# EAGLE schematic EEZ CF-DIC r3B7 (EAGLE 6.1)
Assembly variants: Farnell, TME

## Sheet 1 of 3
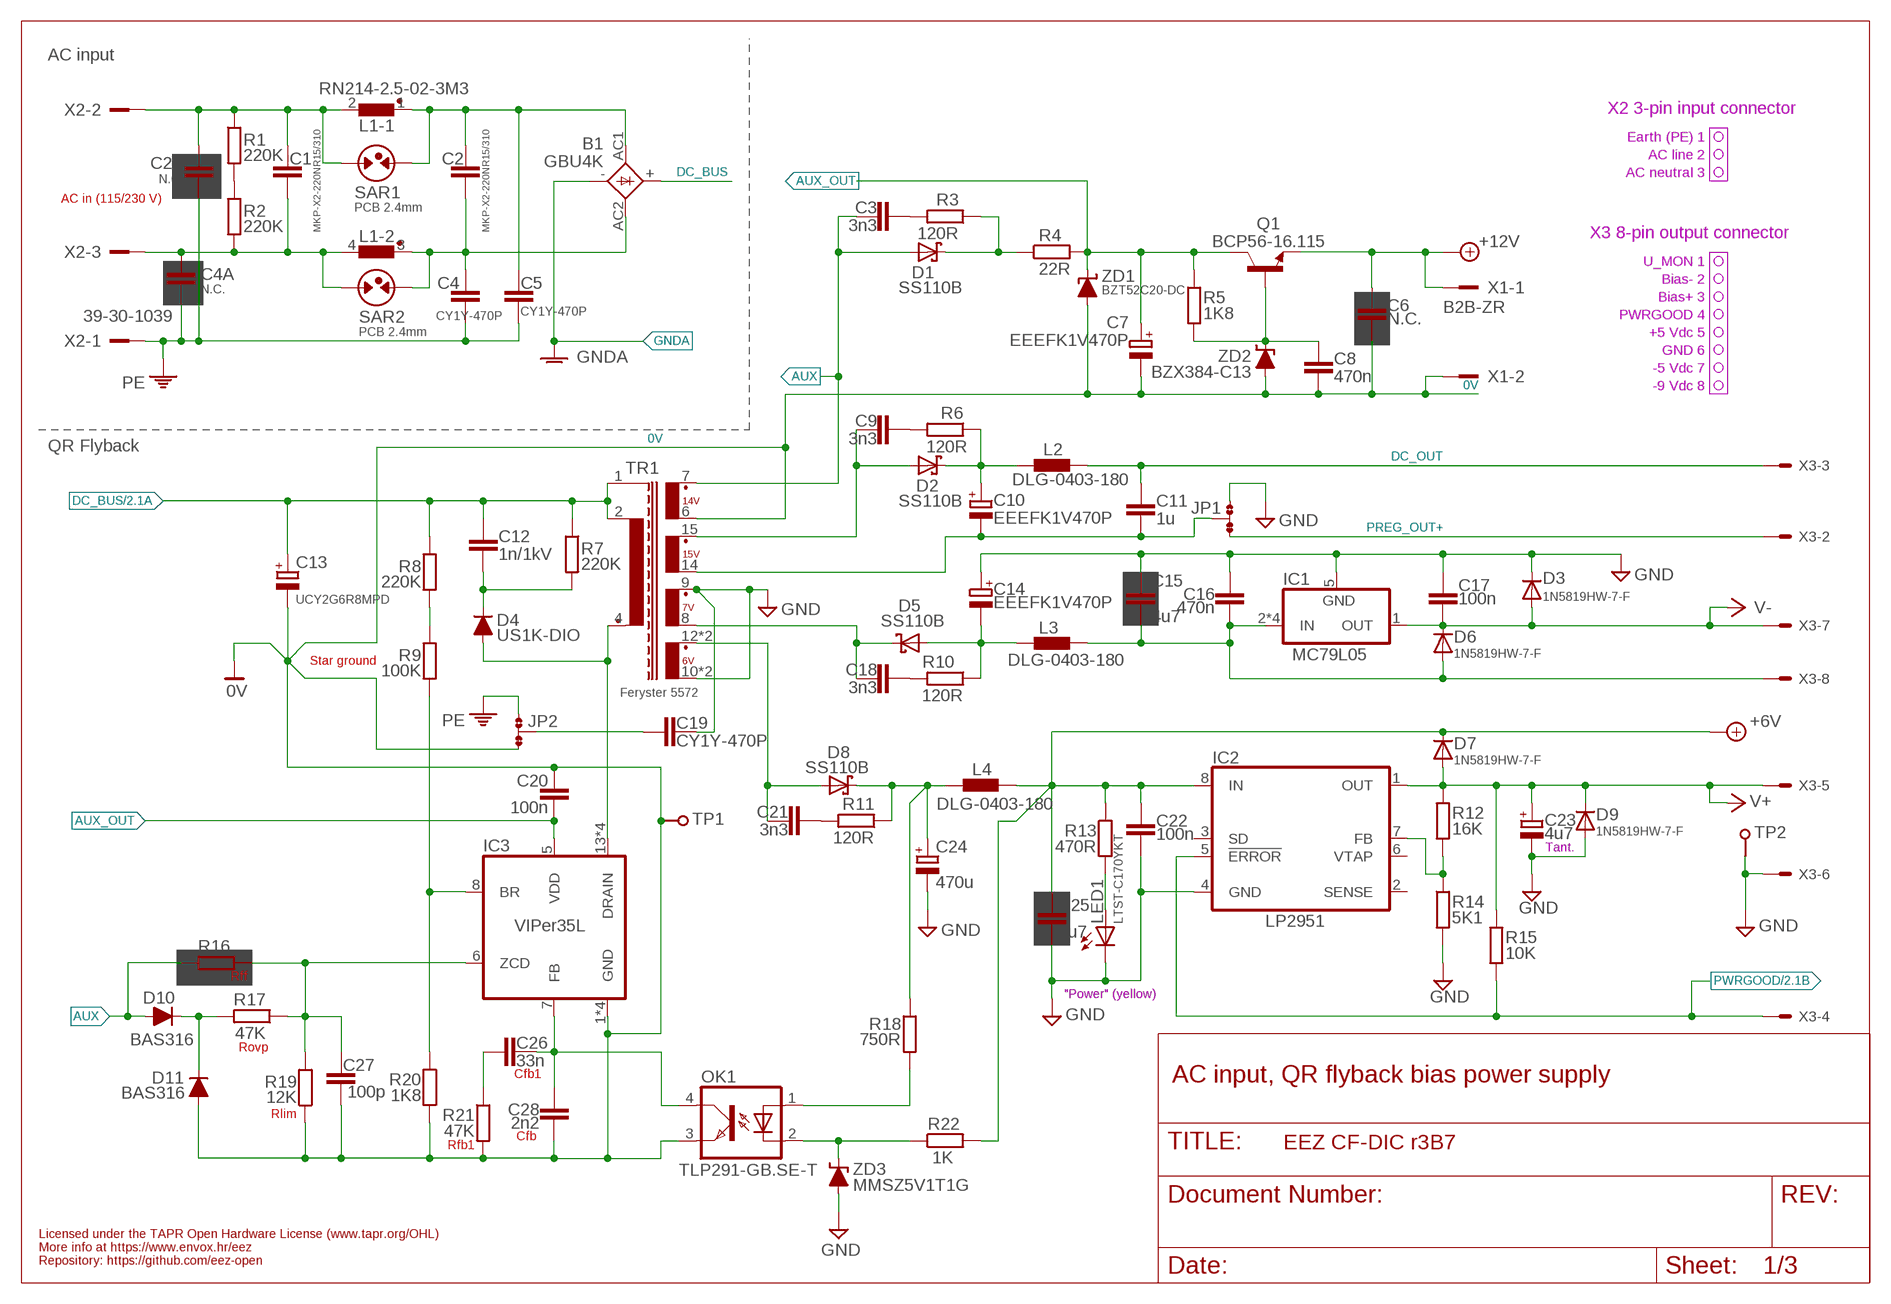
[diagram p0: schematic, sheet 1]

### Parts
B1  GBU4K  BRIDGE-CREEPAGE  [GBU4K_CRE]
C1  MKP-X2-220NR15/310  C-EU150-072X183  [C150-072X183]
C2  MKP-X2-220NR15/310  C-EU150-072X183  [C150-072X183]
C2A  N.C.  C-EUCY  [CY075-032X103]
C3  3n3  C-EUC0805  [C0805]
C4  CY1Y-470P  C-EUCY  [CY075-032X103]
C4A  N.C.  C-EUCY  [CY075-032X103]
C5  CY1Y-470P  C-EUCY  [CY075-032X103]
C6  N.C.  C-EUC0603  [C0603]
C7  EEEFK1V470P  ECAPPANASONIC_H  [CAPAE660X610N]
C8  470n  C-EUC0805  [C0805]
C9  3n3  C-EUC0805  [C0805]
C10  EEEFK1V470P  ECAPPANASONIC_H  [CAPAE660X610N]
C11  1u  C-EUC0805  [C0805]
C12  1n/1kV  C-EUC1210  [C1210]
C13  UCY2G6R8MPD  ECAP5G_10.5MM  [ECAP5/10.5]
C14  EEEFK1V470P  ECAPPANASONIC_H  [CAPAE660X610N]
C15  4u7  C-EUC1206  [C1206]
C16  470n  C-EUC0805  [C0805]
C17  100n  C-EUC0603  [C0603]
C18  3n3  C-EUC0805  [C0805]
C19  CY1Y-470P  C-EUCY  [CY075-032X103]
C20  100n  C-EUC0603  [C0603]
C21  3n3  C-EUC0805  [C0805]
C22  100n  C-EUC0603  [C0603]
C23  4u7  ECAP1206  [EC1206]
C24  470u  ECAP5G_10.5MM  [ECAP5/10.5]
C25  4u7  C-EUC1206  [C1206]
C26  33n  C-EUC0805  [C0805]
C27  100p  C-EUC0805  [C0805]
C28  2n2  C-EUC0805  [C0805]
D1  SS110B  SCHOTTKYSMB  [SMB]
D2  SS110B  SCHOTTKYSMB  [SMB]
D3  1N5819HW-7-F  DIODE-SOD323-W  [SOD323-W]
D4  US1K-DIO  DIODEDO214AA  [DO214AA]
D5  SS110B  SCHOTTKYSMB  [SMB]
D6  1N5819HW-7-F  DIODE-SOD323-W  [SOD323-W]
D7  1N5819HW-7-F  DIODE-SOD323-W  [SOD323-W]
D8  SS110B  SCHOTTKYSMB  [SMB]
D9  1N5819HW-7-F  DIODE-SOD323-W  [SOD323-W]
D10  BAS316  DIODESOD323R  [SOD323-R]
D11  BAS316  DIODESOD323R  [SOD323-R]
IC1  MC79L05  MC79LXXSOIC  [SOIC127P600X173-8N]
IC2  LP2951  LP2951SO8  [SOIC127P600X175-8N]
IC3  VIPer35L  VIPER35  [SOIC-16]
JP1  JP3-CUT  [JP3-CUT]
JP2  JP3-CUT  [JP3-CUT]
L1  RN214-2.5-02-3M3  RN214  [RN214]
L2  DLG-0403-180  DE0403  [DE0403]
L3  DLG-0403-180  DE0403  [DE0403]
L4  DLG-0403-180  DE0403  [DE0403]
LED1  LTST-C170YKT  LED0805  [LED_0805]
OK1  TLP291-GB.SE-T  TLP291  [SO4]
Q1  BCP56-16.115  BCP56  [SOT230P700X180-4N]
R1  220K  R-EU_R1206  [R1206]
R2  220K  R-EU_R1206  [R1206]
R3  120R  R-EU_R0805  [R0805]
R4  22R  R-EU_R0805  [R0805]
R5  1K8  R-EU_R0805  [R0805]
R6  120R  R-EU_R0805  [R0805]
R7  220K  R-EU_R1206  [R1206]
R8  220K  R-EU_R1206  [R1206]
R9  100K  R-EU_R0805  [R0805]
R10  120R  R-EU_R0805  [R0805]
R11  120R  R-EU_R0805  [R0805]
R12  16K  R-EU_R0805  [R0805]
R13  470R  R-EU_R0805  [R0805]
R14  5K1  R-EU_R0805  [R0805]
R15  10K  R-EU_R0805  [R0805]
R16  N.C.  R-EU_R0805  [R0805]
R17  47K  R-EU_R0805  [R0805]
R18  750R  R-EU_R0805  [R0805]
R19  12K  R-EU_R0805  [R0805]
R20  1K8  R-EU_R0805  [R0805]
R21  47K  R-EU_R0805  [R0805]
R22  1K  R-EU_R0805  [R0805]
SAR1  PCB 2.4mm  SARPCB-2.4MM  [PCB-SAR_2.4MM]
SAR2  PCB 2.4mm  SARPCB-2.4MM  [PCB-SAR_2.4MM]
TP1  PCB_TEST_TABSHIELD  [PCB_SHIELD_TAB]
TP2  PCB_TEST_TABSHIELD  [PCB_SHIELD_TAB]
TR1  Feryster 5572  FERYSTER_5572  [FERYSTER_5572]
X1  B2B-ZR  [B2B-ZR]
X2  39-30-1039  MINIFIT_39301039-CREEPAGE  [MINIFIT_39301039_CRE]
X3  90136-1208  C-GRID-08-70543  [70543-08]
ZD1  BZT52C20-DC  ZENER-DIODESOD123FL  [SOD123FL]
ZD2  BZX384-C13  ZENER-DIODESOD323  [SOD323-W]
ZD3  MMSZ5V1T1G  ZENER-DIODESOD323  [SOD323-W]

### Nets
0V: C6.2 C7.2(-) C8.2 C13.- C20.1 C27.2 C28.2 D11.A IC3.1(GND) IC3.2(GND) IC3.3(GND) IC3.4(GND) JP2.NC OK1.3(EMIT) R19.1 R20.2 R21.2 TP1.1 TR1.6(S_BIAS) X1.2 ZD1.A ZD2.A ; also sheet 2
6VAC: C21.2 D8.A TR1.12(S1_DOT) TR1.13(S1_DOT)
7VAC: C18.2 D5.C TR1.8(S2)
15VAC: C9.2 D2.A TR1.15(S3_DOT)
+6V: C22.1 C25.1 D7.C IC2.8(IN) L4.2 R13.1 R22.2 ; also sheet 3
+6V_REC: C24.+ D8.C L4.1 R11.1 R18.1
+12V: C6.1 Q1.3(E) X1.1 ; also sheet 2
+15V_REC: C10.1(+) D2.C L2.1 R6.1
-7V_REC: C14.2(-) D5.A L3.1 R10.1
-9V: C15.2 C16.2 D6.A IC1.2(IN) IC1.3(IN) IC1.6(IN) IC1.7(IN) L3.2 X3.8
-15V: C10.2(-) C11.2 JP1.COM TR1.14(S3)
AUX: C3.2 D1.A D10.A R16.2 TR1.7(S_BIAS_DOT)
AUX_OUT: C7.1(+) C20.2 IC3.5(VDD) Q1.2(C) Q1.4(C) R4.2 R5.1 ZD1.C
DC_BUS: B1.+ C12.1 C13.+ R7.1 R8.1 TR1.1(SHIELD) TR1.2(P) ; also sheet 2
DC_OUT: C11.1 L2.2 X3.3
FB2: OK1.2(C) R22.1 ZD3.C
GND: C14.1(+) C15.1 C16.1 C17.1 C19.2 C22.2 C23.- C24.- C25.2 D3.C D9.A IC1.5(GND) IC2.4(GND) JP1.NO LED1.C R14.2 TP2.1 TR1.9(S2_DOT) TR1.10(S1) TR1.11(S1) X3.6 ZD3.A ; also sheet 2,3
GNDA: B1.- ; also sheet 2
N$4: C19.1 JP2.COM
N$11: LED1.A R13.2
N$15: B1.AC1 C2.1 C5.2 L1.1 SAR1.2
N$20: IC3.8(BR) R9.2 R20.1
N$24: B1.AC2 C2.2 C4.2 L1.3 SAR2.2
N$27: D1.C R3.1 R4.1
N$28: C1.1 C2A.2 L1.2 R1.1 SAR1.1 X2.2
N$30: C1.2 C4A.2 L1.4 R2.2 SAR2.1 X2.3
N$33: R1.2 R2.1
N$49: R8.2 R9.1
N$101: IC2.7(FB) R12.2 R14.1
N$133: C8.1 Q1.1(B) R5.2 ZD2.C
N$135: OK1.1(A) R18.2
N$137: C12.2 D4.C R7.2
N$138: C26.2 C28.1 IC3.7(FB) OK1.4(COL)
N$139: C9.1 R6.2
N$140: C3.1 R3.2
N$141: C27.1 IC3.6(ZCD) R16.1 R17.1 R19.2
N$144: C18.1 R10.2
N$146: C21.1 R11.2
N$152: C26.1 R21.1
N$155: D10.C D11.C R17.2
PE: C2A.1 C4.1 C4A.1 C5.1 JP2.NO X2.1
PREG_OUT+: JP1.NC X3.2 ; also sheet 3
PWRGOOD: IC2.5(!ERROR) R15.2 X3.4 ; also sheet 2
V+: C23.+ D7.A D9.C IC2.1(OUT) R12.1 R15.1 X3.5 ; also sheet 3
V-: C17.2 D3.A D6.C IC1.1(OUT) X3.7 ; also sheet 3
VIPER_D: D4.A IC3.13(DRAIN) IC3.14(DRAIN) IC3.15(DRAIN) IC3.16(DRAIN) TR1.4(P2_DOT)
Unconnected: IC2.2(SENSE) IC2.3(SD) IC2.6(VTAP)

### Notes on the sheet
- AC input
- X2 3-pin input connector
- Earth (PE) 1
- AC line 2
- AC neutral 3
- AC in (115/230 V)
- X3 8-pin output connector
- U_MON 1
- Bias- 2
- Bias+ 3
- PWRGOOD 4
- +5 Vdc 5
- GND 6
- -5 Vdc 7
- -9 Vdc 8
- QR Flyback
- Star ground
- Tant.
- Rff
- "Power" (yellow)
- Rovp
- Cfb1
- AC input, QR flyback bias power supply
- Rlim
- Cfb
- Rfb1
- Licensed under the TAPR Open Hardware License (www.tapr.org/OHL)
- More info at https://www.envox.hr/eez
- Repository: https://github.com/eez-open

## Sheet 2 of 3
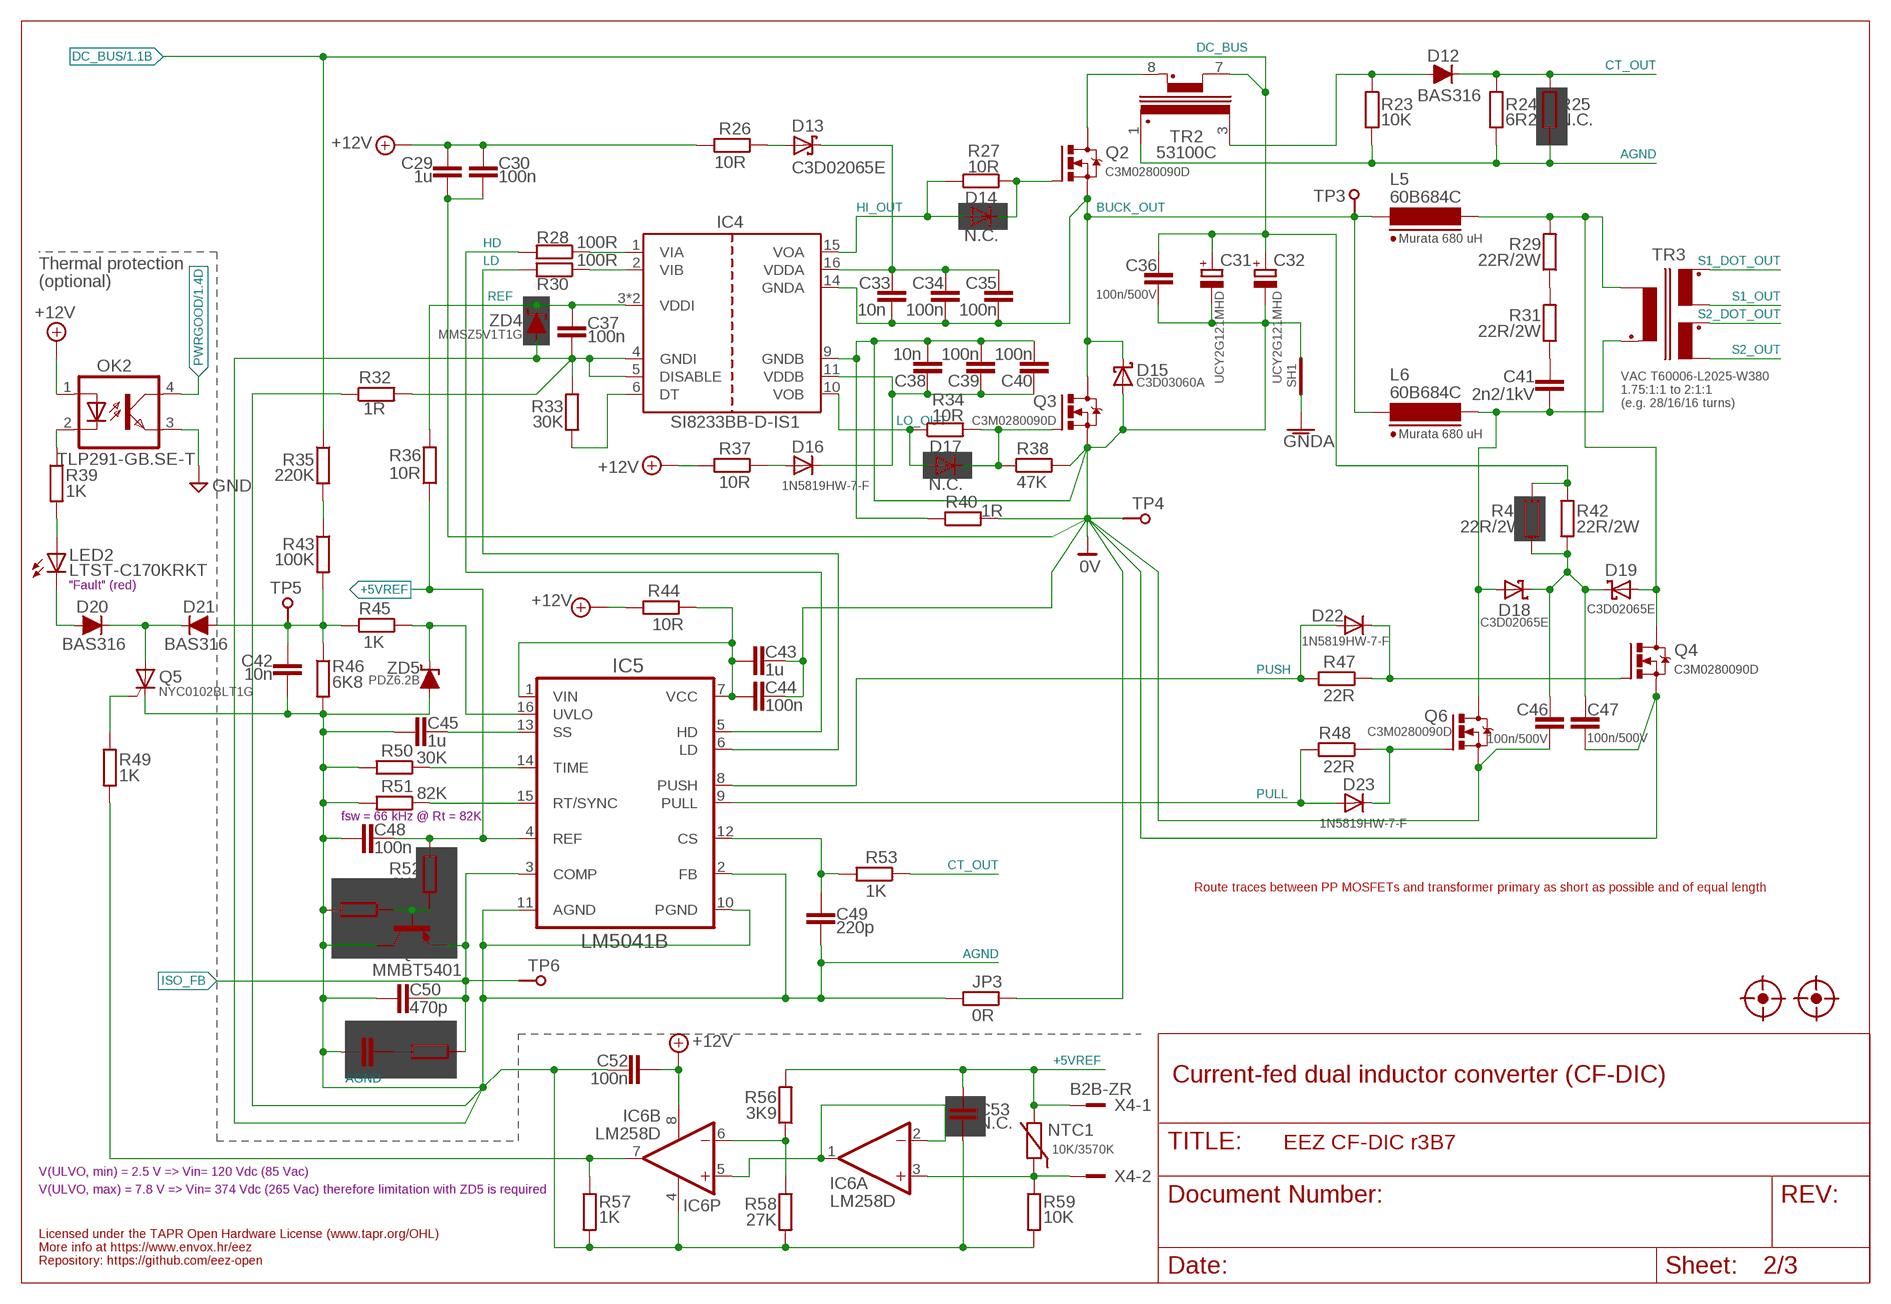
[diagram p1: schematic, sheet 2]

### Parts
C29  1u  C-EUC0805  [C0805]
C30  100n  C-EUC0603  [C0603]
C31  UCY2G121MHD  ECAP7.5G_18MM  [ECAP7.5/18]
C32  UCY2G121MHD  ECAP7.5G_18MM  [ECAP7.5/18]
C33  10n  C-EUC0603  [C0603]
C34  100n  C-EUC0603  [C0603]
C35  100n  C-EUC0603  [C0603]
C36  100n/500V  C-EUC1812  [C1812]
C37  100n  C-EUC0603  [C0603]
C38  10n  C-EUC0603  [C0603]
C39  100n  C-EUC0603  [C0603]
C40  100n  C-EUC0603  [C0603]
C41  2n2/1kV  C-EUC1210  [C1210]
C42  10n  C-EUC0603  [C0603]
C43  1u  C-EUC0805  [C0805]
C44  100n  C-EUC0603  [C0603]
C45  1u  C-EUC0805  [C0805]
C46  100n/500V  C-EUC1812  [C1812]
C47  100n/500V  C-EUC1812  [C1812]
C48  100n  C-EUC0603  [C0603]
C49  220p  C-EUC0805  [C0805]
C50  470p  C-EUC0805  [C0805]
C51  N.C.  C-EUC0805  [C0805]
C52  100n  C-EUC0603  [C0603]
C53  N.C.  C-EUC0603  [C0603]
D12  BAS316  DIODESOD323R  [SOD323-R]
D13  C3D02065E  SCHOTTKY-SIC  [TO252]
D14  N.C.  DIODE-SOD323-W  [SOD323-W]
D15  C3D03060A  SCHOTTKY-TO220  [TO220-2]
D16  1N5819HW-7-F  DIODE-SOD323-W  [SOD323-W]
D17  N.C.  DIODE-SOD323-W  [SOD323-W]
D18  C3D02065E  SCHOTTKY-SIC  [TO252]
D19  C3D02065E  SCHOTTKY-SIC  [TO252]
D20  BAS316  DIODESOD323R  [SOD323-R]
D21  BAS316  DIODESOD323R  [SOD323-R]
D22  1N5819HW-7-F  DIODE-SOD323-W  [SOD323-W]
D23  1N5819HW-7-F  DIODE-SOD323-W  [SOD323-W]
FM1  FIDUCIAL_2  [FIDUCIAL_DUAL]
FM2  FIDUCIAL_2  [FIDUCIAL_DUAL]
IC4  SI8233BB-D-IS1  SI8233  [SOIC-16]
IC5  LM5041B  LM5041  [MTC16]
IC6  LM258D  TL072SOIC8  [SOIC127P600X173-8N]
JP3  0R  R-EU_R0805  [R0805]
L5  60B684C  MURATA_6000B  [MURATA_6000B]
L6  60B684C  MURATA_6000B  [MURATA_6000B]
LED2  LTST-C170KRKT  LED0805  [LED_0805]
NTC1  10K/3570K  NTCR_0805  [R_0805]
OK2  TLP291-GB.SE-T  TLP291  [SO4]
Q2  C3M0280090D  IRFP240  [TO247BV]
Q3  C3M0280090D  IRFP240  [TO247BV]
Q4  C3M0280090D  IRFP240  [TO247BV]
Q5  NYC0102BLT1G  [SOT23]
Q6  C3M0280090D  IRFP240  [TO247BV]
Q7  MMBT5401  BC857B-PNP-SOT23-BEC  [SOT23-BEC]
R23  10K  R-EU_R0805  [R0805]
R24  6R2  R-EU_R0805  [R0805]
R25  N.C.  R-EU_R0805  [R0805]
R26  10R  R-EU_R0805  [R0805]
R27  10R  R-EU_R0805  [R0805]
R28  100R  R-EU_R0805  [R0805]
R29  22R/2W  R-EU_R2512  [R2512]
R30  100R  R-EU_R0805  [R0805]
R31  22R/2W  R-EU_R2512  [R2512]
R32  1R  R-EU_R0805  [R0805]
R33  30K  R-EU_R0805  [R0805]
R34  10R  R-EU_R0805  [R0805]
R35  220K  R-EU_R1206  [R1206]
R36  10R  R-EU_R0805  [R0805]
R37  10R  R-EU_R0805  [R0805]
R38  47K  R-EU_R0805  [R0805]
R39  1K  R-EU_R0805  [R0805]
R40  1R  R-EU_R0805  [R0805]
R41  22R/2W  R-EU_R2512  [R2512]
R42  22R/2W  R-EU_R2512  [R2512]
R43  100K  R-EU_R0805  [R0805]
R44  10R  R-EU_R0805  [R0805]
R45  1K  R-EU_R0805  [R0805]
R46  6K8  R-EU_R0805  [R0805]
R47  22R  R-EU_R0805  [R0805]
R48  22R  R-EU_R0805  [R0805]
R49  1K  R-EU_R0805  [R0805]
R50  30K  R-EU_R0805  [R0805]
R51  82K  R-EU_R0805  [R0805]
R52  6K8  R-EU_R0805  [R0805]
R53  1K  R-EU_R0805  [R0805]
R54  6K8  R-EU_R0805  [R0805]
R55  N.C.  R-EU_R0805  [R0805]
R56  3K9  R-EU_R0805  [R0805]
R57  1K  R-EU_R0805  [R0805]
R58  27K  R-EU_R0805  [R0805]
R59  10K  R-EU_R0805  [R0805]
SH1  SHORTNOHOLE  [SHORT_NOHOLE]
TP3  PCB_TEST_TABSHIELD  [PCB_SHIELD_TAB]
TP4  PCB_TEST_TABSHIELD  [PCB_SHIELD_TAB]
TP5  PCB_TEST_TABSHIELD  [PCB_SHIELD_TAB]
TP6  PCB_TEST_TABSHIELD  [PCB_SHIELD_TAB]
TR2  53100C  MURATA_5300  [MURATA_5300]
TR3  VAC T60006-L2025-W380  PCB_TRAFO_FLYBACK2-VAC  [VAC_DUAL_SEC]
X4  B2B-ZR  [B2B-ZR]
ZD4  MMSZ5V1T1G  ZENER-DIODESOD323  [SOD323-W]
ZD5  PDZ6.2B  ZENER-DIODESOD323  [SOD323-W]

### Nets
0V: C29.1 C30.1 C31.- C32.- C36.1 C38.2 C39.2 C40.2 C43.2 C44.2 C46.1 C47.1 D15.2(A) IC4.9(GNDB) JP3.1 Q3.S Q4.S Q6.S R38.2 R40.1 R40.2 SH1.P$2(GND_B) TP4.1 ; also sheet 1
+5VREF: C48.2 C53.1 IC5.4(REF) NTC1.1 R36.1 R52.1 R56.2 X4.1
+12V: C29.2 C30.2 C52.1 IC6.8(P:V+) OK2.1(A) R26.2 R37.2 R44.2 ; also sheet 1
AGND: C37.1 C42.2 C45.1 C48.1 C49.1 C50.1 C51.1 C52.2 C53.2 IC4.4(GNDI) IC4.5(DISABLE) IC5.2(FB) IC5.10(PGND) IC5.11(AGND) IC6.4(P:V-) JP3.2 Q5.1(C) Q7.C R23.2 R24.2 R25.2 R32.1 R32.2 R33.1 R46.2 R50.2 R51.2 R54.2 R57.2 R58.2 R59.2 TR2.1(S_DOT) ZD4.A ZD5.A ; also sheet 3
BUCK_OUT: C33.2 C34.2 C35.2 D15.1(C) IC4.14(GNDA) L5.2 L6.2 Q2.S Q3.D TP3.1
CLAMP_C: C46.2 C47.2 D18.1(C) D18.3(C) D19.1(C) D19.3(C) R41.1 R42.1
CT_OUT: D12.C R24.1 R25.1 R53.1
DC_BUS: C31.+ C32.+ C36.2 R35.1 R41.2 R42.2 TR2.7(P) ; also sheet 1
GND: OK2.3(EMIT) ; also sheet 1,3
GNDA: SH1.P$1(GND_A) ; also sheet 1
HD: IC5.5(HD) R28.2
HI_OUT: D14.A IC4.15(VOA) R27.2
ISO_FB: C50.2 IC5.3(COMP) Q7.E R55.1 TP6.1 ; also sheet 3
L_PULL: C41.2 D18.2(A) L6.1 Q6.D TR3.P1_DOT(P_DOT)
L_PUSH: D19.2(A) L5.1 Q4.D R29.2 TR3.P1(P)
LD: IC5.6(LD) R30.2
LO_OUT: D17.A IC4.10(VOB) R34.1
N$2: R35.2 R43.1
N$3: C33.1 C34.1 C35.1 D13.1(C) D13.3(C) IC4.16(VDDA)
N$5: C41.1 R31.1
N$7: IC6.3(A:+IN) NTC1.2 R59.1 X4.2
N$13: D22.C Q4.G R47.1
N$14: D23.C Q6.G R48.1
N$16: LED2.A R39.2
N$19: IC5.15(RT/SYNC) R51.1
N$21: D14.C Q2.G R27.1
N$22: IC5.14(TIME) R50.1
N$23: C45.2 IC5.13(SS)
N$25: IC5.16(UVLO) R45.1 ZD5.C
N$26: IC6.6(B:-IN) R56.1 R58.1
N$29: D17.C Q3.G R34.2 R38.1
N$31: D13.2(A) R26.1
N$32: OK2.2(C) R39.1
N$35: C51.2 R55.2
N$36: IC4.1(VIA) R28.1
N$37: C49.2 IC5.12(CS) R53.2
N$38: IC6.7(B:OUT) R49.2 R57.1
N$40: IC4.2(VIB) R30.1
N$41: R29.1 R31.2
N$42: IC6.1(A:OUT) IC6.2(A:-IN) IC6.5(B:+IN)
N$47: Q7.B R52.2 R54.1
N$48: IC4.6(DT) R33.2
N$50: D12.A R23.1 TR2.3(S)
N$54: C43.1 C44.1 IC5.1(VIN) IC5.7(VCC) R44.1
N$55: C38.1 C39.1 C40.1 D16.C IC4.11(VDDB)
N$56: Q2.D TR2.8(P_DOT)
N$63: D16.A R37.1
N$100: Q5.2(G) R49.1
N$126: D20.C D21.C Q5.3(A)
N$130: D20.A LED2.C
PULL: D23.A IC5.9(PULL) R48.2
PUSH: D22.A IC5.8(PUSH) R47.2
PWRGOOD: OK2.4(COL) ; also sheet 1
REF: C37.2 IC4.3(VDDI) IC4.8(VDDI) R36.2 ZD4.C
S1_DOT_OUT: TR3.S1_DOT ; also sheet 3
S1_OUT: TR3.S1 ; also sheet 3
S2_DOT_OUT: TR3.S2_DOT ; also sheet 3
S2_OUT: TR3.S2 ; also sheet 3
ULVO: C42.1 D21.A R43.2 R45.2 R46.1 TP5.1

### Notes on the sheet
- Murata 680 uH
- Thermal protection
- (optional)
- 1.75:1:1 to 2:1:1
- (e.g. 28/16/16 turns)
- Murata 680 uH
- "Fault" (red)
- fsw = 66 kHz @ Rt = 82K
- Route traces between PP MOSFETs and transformer primary as short as possible and of equal length
- Current-fed dual inductor converter (CF-DIC)
- V(ULVO, min) = 2.5 V => Vin= 120 Vdc (85 Vac)
- V(ULVO, max) = 7.8 V => Vin= 374 Vdc (265 Vac) therefore limitation with ZD5 is required
- Licensed under the TAPR Open Hardware License (www.tapr.org/OHL)
- More info at https://www.envox.hr/eez
- Repository: https://github.com/eez-open

## Sheet 3 of 3
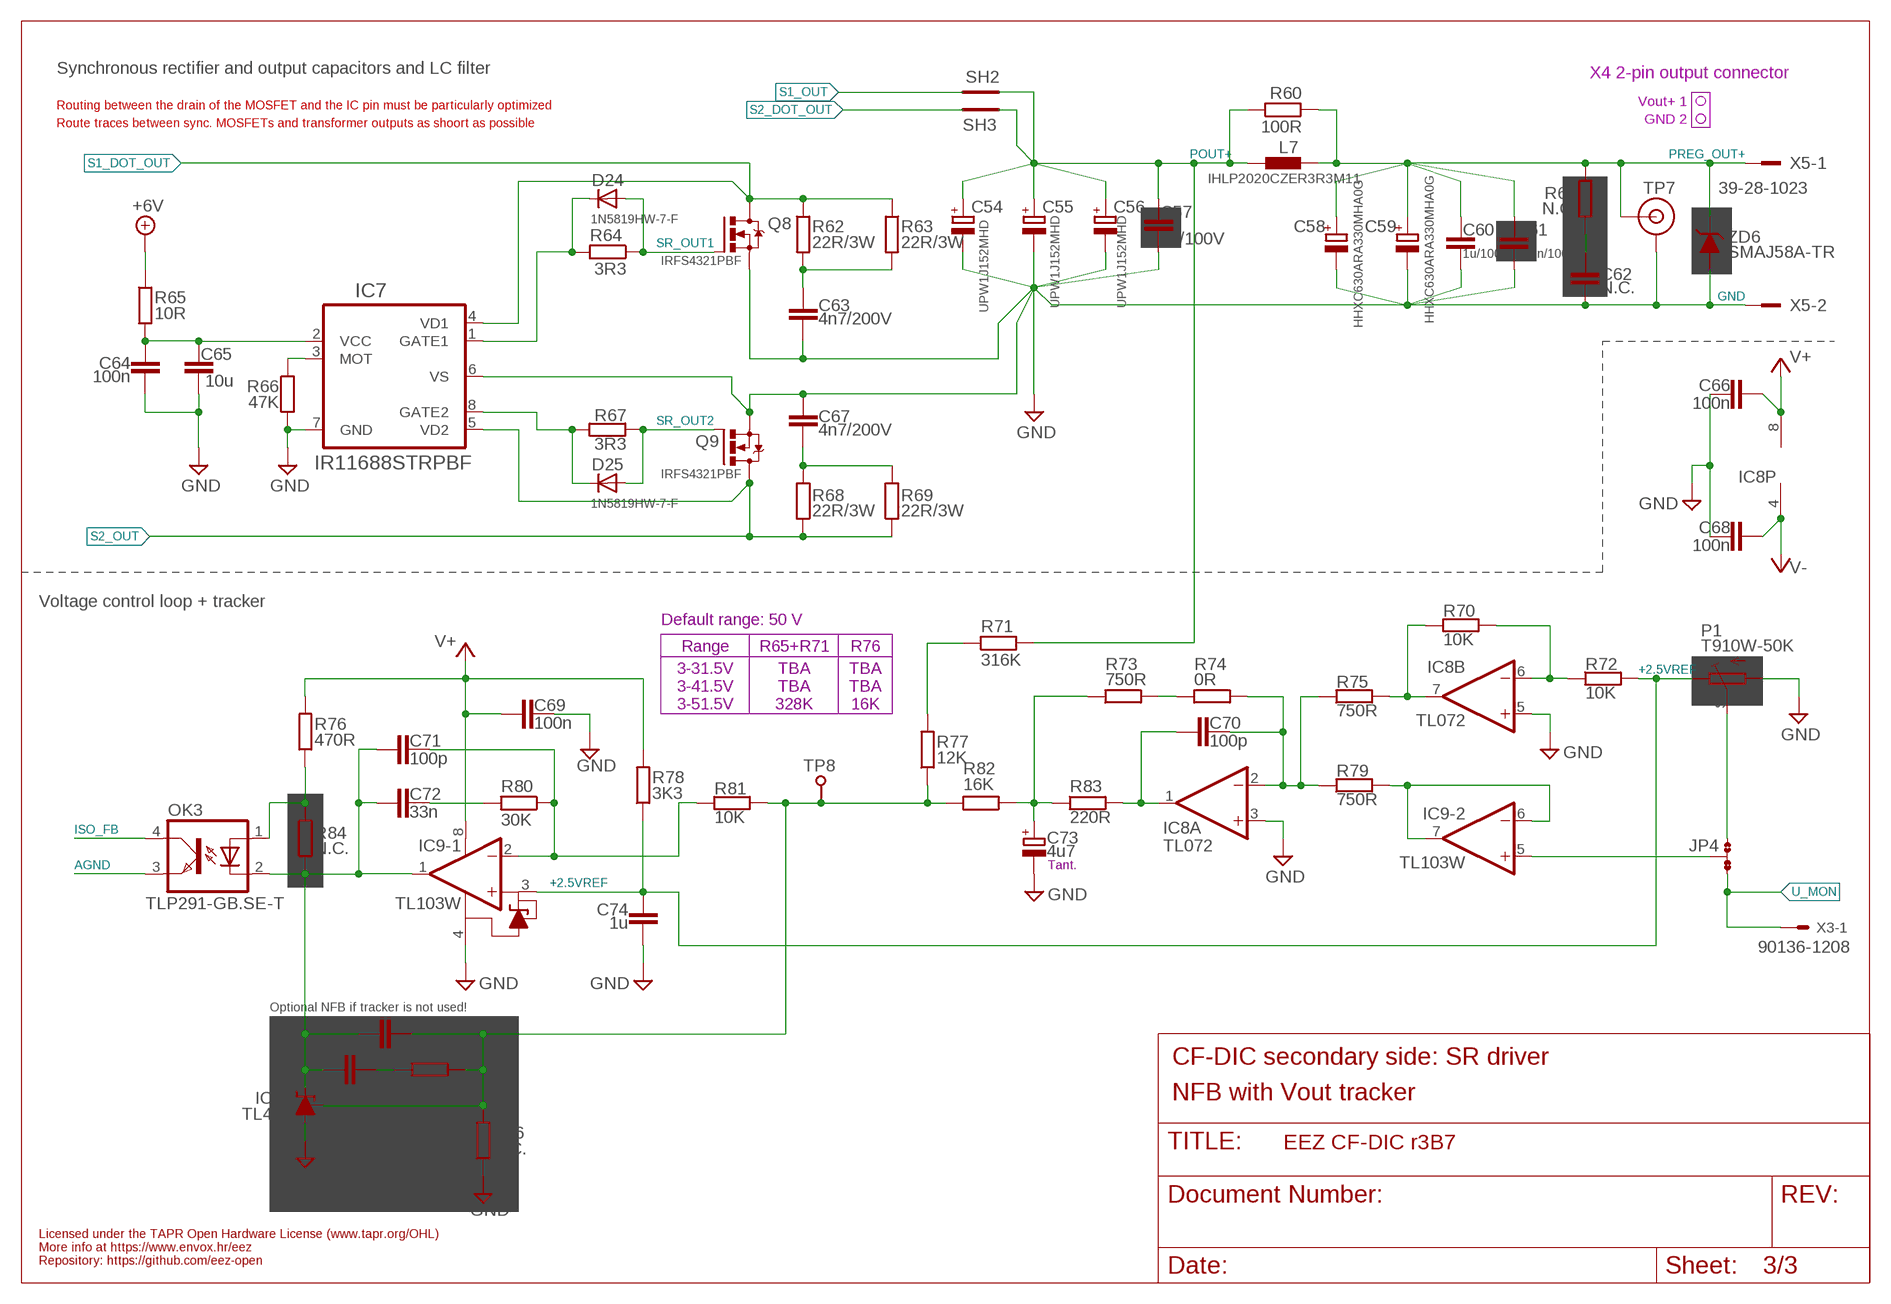
[diagram p2: schematic, sheet 3]

### Parts
C54  UPW1J152MHD  ECAP7.5G_18MM  [ECAP7.5/18]
C55  UPW1J152MHD  ECAP7.5G_18MM  [ECAP7.5/18]
C56  UPW1J152MHD  ECAP7.5G_18MM  [ECAP7.5/18]
C57  1u/100V  C-EUC1206  [C1206]
C58  HHXC630ARA330MHA0G  EEE-FK1J470P-CASE-F  [CAPAE830X1050N]
C59  HHXC630ARA330MHA0G  EEE-FK1J470P-CASE-F  [CAPAE830X1050N]
C60  1u/100V  C-EUC1206  [C1206]
C61  100n/100V  C-EUC0805  [C0805]
C62  N.C.  C-EUC1206  [C1206]
C63  4n7/200V  C-EUC1206  [C1206]
C64  100n  C-EUC0603  [C0603]
C65  10u  C-EUC1210  [C1210]
C66  100n  C-EUC0603  [C0603]
C67  4n7/200V  C-EUC1206  [C1206]
C68  100n  C-EUC0603  [C0603]
C69  100n  C-EUC0603  [C0603]
C70  100p  C-EUC0805  [C0805]
C71  100p  C-EUC0805  [C0805]
C72  33n  C-EUC0805  [C0805]
C73  4u7  ECAP1206  [EC1206]
C74  1u  C-EUC0805  [C0805]
C75  N.C.  C-EUC0805  [C0805]
C76  N.C.  C-EUC0805  [C0805]
D24  1N5819HW-7-F  DIODE-SOD323-W  [SOD323-W]
D25  1N5819HW-7-F  DIODE-SOD323-W  [SOD323-W]
IC7  IR11688STRPBF  IR11688  [SO8]
IC8  TL072  TL072SOIC8  [SOIC127P600X173-8N]
IC9  TL103W  [SOIC127P600X173-8N]
IC10  TL431  [SOT103P240X110-3N]
JP4  JP3-CUT  [JP3-CUT]
L7  IHLP2020CZER3R3M11  IHLP-2020BZ-11  [IHLP-2020BZ-11]
OK3  TLP291-GB.SE-T  TLP291  [SO4]
P1  T910W-50K  TPOT-S64W  [S64W]
Q8  IRFS4321PBF  N-MOSFETTO263  [TO263]
Q9  IRFS4321PBF  N-MOSFETTO263  [TO263]
R60  100R  R-EU_R0805  [R0805]
R61  N.C.  R-EU_R1210  [R1210]
R62  22R/3W  R-EU_R2512  [R2512]
R63  22R/3W  R-EU_R2512  [R2512]
R64  3R3  R-EU_R0805  [R0805]
R65  10R  R-EU_R0805  [R0805]
R66  47K  R-EU_R0805  [R0805]
R67  3R3  R-EU_R0805  [R0805]
R68  22R/3W  R-EU_R2512  [R2512]
R69  22R/3W  R-EU_R2512  [R2512]
R70  10K  R-EU_R0805  [R0805]
R71  316K  R-EU_R0805  [R0805]
R72  10K  R-EU_R0805  [R0805]
R73  750R  R-EU_R0805  [R0805]
R74  0R  R-EU_R0805  [R0805]
R75  750R  R-EU_R0805  [R0805]
R76  470R  R-EU_R0805  [R0805]
R77  12K  R-EU_R0805  [R0805]
R78  3K3  R-EU_R0805  [R0805]
R79  750R  R-EU_R0805  [R0805]
R80  30K  R-EU_R0805  [R0805]
R81  10K  R-EU_R0805  [R0805]
R82  16K  R-EU_R0805  [R0805]
R83  220R  R-EU_R0805  [R0805]
R84  N.C.  R-EU_R0805  [R0805]
R85  N.C.  R-EU_R0805  [R0805]
R86  N.C.  R-EU_R0805  [R0805]
SH2  SHORTNOHOLE  [SHORT_NOHOLE]
SH3  SHORTNOHOLE  [SHORT_NOHOLE]
TP7  TEST_POINT-2  [TP_1.1MM_2]
TP8  PCB_TEST_TABSHIELD  [PCB_SHIELD_TAB]
X5  39-28-1023  MINIFIT_5566-02A  [MINIFIT_5566-02A]
ZD6  SMAJ58A-TR  PSMAXX  [DO214AC]

### Nets
+2.5VREF: C74.1 IC9.3(-1:+IN1) P1.E R72.2 R78.1
+6V: R65.1 ; also sheet 1
AGND: OK3.3(EMIT) ; also sheet 2
FB: C75.2 IC10.2(REF) R77.1 R81.2 R82.2 R85.2 R86.2 TP8.1
GND: C54.- C55.- C56.- C57.2 C58.2 C59.2 C60.2 C61.2 C62.1 C63.2 C64.2 C65.2 C66.2 C67.2 C68.2 C69.2 C73.- C74.2 IC7.6(VS) IC7.7(GND) IC8.3(A:+IN) IC8.5(B:+IN) IC9.4(-1:VCC-) IC10.3(A) P1.A Q8.2(S) Q9.2(S) R66.2 R86.1 TP7.GND X5.2 ZD6.A ; also sheet 1,2
ISO_FB: OK3.4(COL) ; also sheet 2
N$1: C70.2 IC8.2(A:-IN) R74.2 R75.1 R79.1
N$6: C64.1 C65.1 IC7.2(VCC) R65.2
N$8: C62.2 R61.1
N$9: C72.2 R80.2
N$10: C71.2 IC9.2(-1:-IN1) R80.1 R81.1
N$12: R71.1 R77.2
N$17: C76.2 R85.1
N$18: IC7.3(MOT) R66.1
N$53: IC8.7(B:OUT) R70.1 R75.2
N$57: IC9.5(-2:+IN) JP4.COM
N$58: JP4.NO P1.S
N$64: R73.2 R74.1
N$66: C63.1 R62.2 R63.2
N$67: C67.1 R68.2 R69.2
N$74: D24.C IC7.1(GATE1) R64.2
N$75: D25.C IC7.8(GATE2) R67.2
N$76: C71.1 C72.1 C75.1 C76.1 IC9.1(-1:OUT1) IC10.1(C) OK3.2(C) R84.2
N$132: IC8.6(B:-IN) R70.2 R72.1
N$134: C70.1 IC8.1(A:OUT) R83.2
NFB_OFFSET: C73.+ R73.1 R82.1 R83.1
OK_A: OK3.1(A) R76.1 R84.1
POUT+: C54.+ C55.+ C56.+ C57.1 L7.1 R60.1 R71.2 SH2.P$2(GND_B) SH3.P$1(GND_A)
PREG_OUT+: C58.1 C59.1 C60.1 C61.1 L7.2 R60.2 R61.2 TP7.TIP X5.1 ZD6.C ; also sheet 1
S1_DOT_OUT: IC7.4(VD1) Q8.3(D) R62.1 R63.1 ; also sheet 2
S1_OUT: SH2.P$1(GND_A) ; also sheet 2
S2_DOT_OUT: SH3.P$2(GND_B) ; also sheet 2
S2_OUT: IC7.5(VD2) Q9.3(D) R68.1 R69.1 ; also sheet 2
SR_OUT1: D24.A Q8.1(G) R64.1
SR_OUT2: D25.A Q9.1(G) R67.1
U_MON: JP4.NC X3.1
U_MON1: IC9.6(-2:-IN) IC9.7(-2:OUT) R79.2
V+: C66.1 C69.1 IC8.8(P:V+) IC9.8(-1:VCC+) R76.2 R78.2 ; also sheet 1
V-: C68.1 IC8.4(P:V-) ; also sheet 1

### Notes on the sheet
- Synchronous rectifier and output capacitors and LC filter | X4 2-pin output connector
- Vout+ 1
- Routing between the drain of the MOSFET and the IC pin must be particularly optimized
- GND 2
- Route traces between sync. MOSFETs and transformer outputs as shoort as possible
- Voltage control loop + tracker
- Default range: 50 V
- Range | R65+R71 | R76
- 3-31.5V | TBA | TBA
- 3-41.5V | TBA | TBA
- 3-51.5V | 328K | 16K
- Tant.
- Optional NFB if tracker is not used!
- CF-DIC secondary side: SR driver
- NFB with Vout tracker
- Licensed under the TAPR Open Hardware License (www.tapr.org/OHL)
- More info at https://www.envox.hr/eez
- Repository: https://github.com/eez-open

## Library data of the parts
B1 = EEZ_Lib1:BRIDGE
C1-C3 C6 C8 C9 C11 C12 C15-C18 C20-C22 C25-C30 C33-C53 C57 C60-C72 C74-C76 = rcl:C-EU: CAPACITOR, European symbol
C2A C4 C4A C5 C19 = EEZ_Lib1:C-EU
C7 C10 C13 C14 C23 C24 C31 C32 C54-C56 C73 = EEZ_Lib1:ECAP
C58 C59 = Panasonic-EEEFK_EEEFP:EEE-: Aluminum Electrolytic Capacitors,Surface Mount Type; MPN: EEE-FK1J470P; OC_FARNELL: 9696032; OC_NEWARK: 96K9403; PACKAGE: CASE-F; SUPPLIER: PANASONIC; TOLERANCE: ±20 %; VALUE: 47UF; VOLTAGERATING: 63 V
D1 D2 D5 D8 D13 D15 D18 D19 = EEZ_Lib1:SCHOTTKY
D3 D6 D7 D9 D14 D16 D17 D22-D25 = diode:DIODE-: DIODE
D4 D10-D12 D20 D21 = EEZ_Lib1:DIODE
FM1 FM2 = EEZ_Lib1:FIDUCIAL: Fiducial mark for pick and place automation
IC1 = EEZ_Lib1:MC79LXX: 3-terminal negative voltage regulator, up to 100mA
IC2 = EEZ_Lib1:LP2951: LP2950-N/LP2951-N Series of Adjustable Micropower Voltage Regulators
IC3 = EEZ_Lib1:VIPER35: Quasi-resonant high performance off line high voltage converter, 800 V
IC4 = EEZ_Lib1:SI8233: Dual 4.0 Amp ISOdrivers with deadtime control and overlap protection
IC5 = EEZ_Lib1:LM5041: Cascaded PWM Controller; MANUFACTURER_PART_NUMBER: lm5041mtcnopb; VENDOR: TI
IC6 IC8 = EEZ_Lib1:TL072
IC7 = EEZ_Lib1:IR11688: Dual smart rectifier driver IC with programmable MOT
IC9 = EEZ_Lib1:TL103W: Dual Operational Amplifiers With Internal Reference
IC10 = EEZ_Lib1:TL431: Precision programmable reference
JP1 JP2 JP4 = EEZ_Lib1:JP3-CUT: 2-way SMT jumper with one position connected
JP3 R1-R86 = rcl:R-EU_: RESISTOR, European symbol
L1 = EEZ_inductors_and_transformers:RN214: Schaffner EMC/EMI current-compensated chokes, vertical case; FARNELL: 1191518
L2-L4 = EEZ_inductors_and_transformers:DE0403: Ferrocore SMD power coil 4.0 x 4.5 mm
L5 L6 = EEZ_inductors_and_transformers:MURATA_6000B: Surface Mount Power Inductors (47μH to 680μH)
L7 = EEZ_inductors_and_transformers:IHLP-2020BZ-11: Low Profile, High Current IHLP® Inductors
LED1 LED2 = EEZ_Lib1:LED
NTC1 = EEZ_Lib1:NTC
OK1-OK3 = EEZ_Lib1:TLP291: Toshiba Photocopler GaAs IRED & Photo-transistor
P1 = EEZ_Lib1:TPOT
Q1 = EEZ_Lib1:BCP56: Low power NPN Transistor, Vceo=80V, Ic=1A, SOT-223
Q2-Q4 Q6 = EEZ_Lib1:IRFP240: N-channel MOSFET (TO-247)
Q5 = EEZ_Lib1:NYC0102BLT1G: Surface Mount Thyristor, High dv/dt, 200V
Q7 = transistor:*-PNP-: PNP Transistror
Q8 Q9 = EEZ_Lib1:N-MOSFET
SAR1 SAR2 = EEZ_Lib1:SAR: EPCOS surge arrester EF470X Farnell: 1886596
SH1-SH3 = EEZ_Lib1:SHORT
TP1-TP6 TP8 = EEZ_Lib1:PCB_TEST_TAB
TP7 = EEZ_Lib1:TEST_POINT: Test point for oscilloscope probe
TR1 = EEZ_inductors_and_transformers:FERYSTER_5572
TR2 = EEZ_inductors_and_transformers:MURATA_5300: 10A Current sensing transformers
TR3 = EEZ_inductors_and_transformers:PCB_TRAFO_FLYBACK2: PCB flyback transformer, dual secondary, no AUX
X1 X4 = EEZ_Lib1:B2B-ZR: JST Socket; wire-board; male; ZH; 1.5mm; PIN:2; THT; 50V; 1A
X2 = EEZ_Lib1:MINIFIT_39301039: MOLEX socket; wire-board; male; Mini-Fit Jr; 4.2mm; PIN:3; THT; PCB snap
X3 = con-molex:C-GRID-08: CONNECTOR wire to board 2.54 mm (0.100") pitch header; OC_FARNELL: unknown; OC_NEWARK: unknown
X5 = EEZ_Lib1:MINIFIT_5566-02A: Molex Socket; wire-board; male; Mini-Fit Jr; 4.2mm; PIN:2; THT; 9A; tinned
ZD1-ZD5 = EEZ_Lib1:ZENER-DIODE
ZD6 = EEZ_Lib1:PSMAXX: Transient Voltage Suppressor, TVS, P4SMA Series, Unidirectional

## Net classes
0 default: width 0.203 mm, drill 0.3 mm, clearance 0.203 mm
1 lvds: width 0.152 mm, drill 0.3 mm, clearance 0.152 mm to class 0, clearance 0.152 mm
2 gnd: width 0.254 mm, drill 0.584 mm, clearance 0.254 mm